# Altium schematic sheet ESP32-S2.SchDoc
size B; SheetNumber: 5; SheetTotal: 9
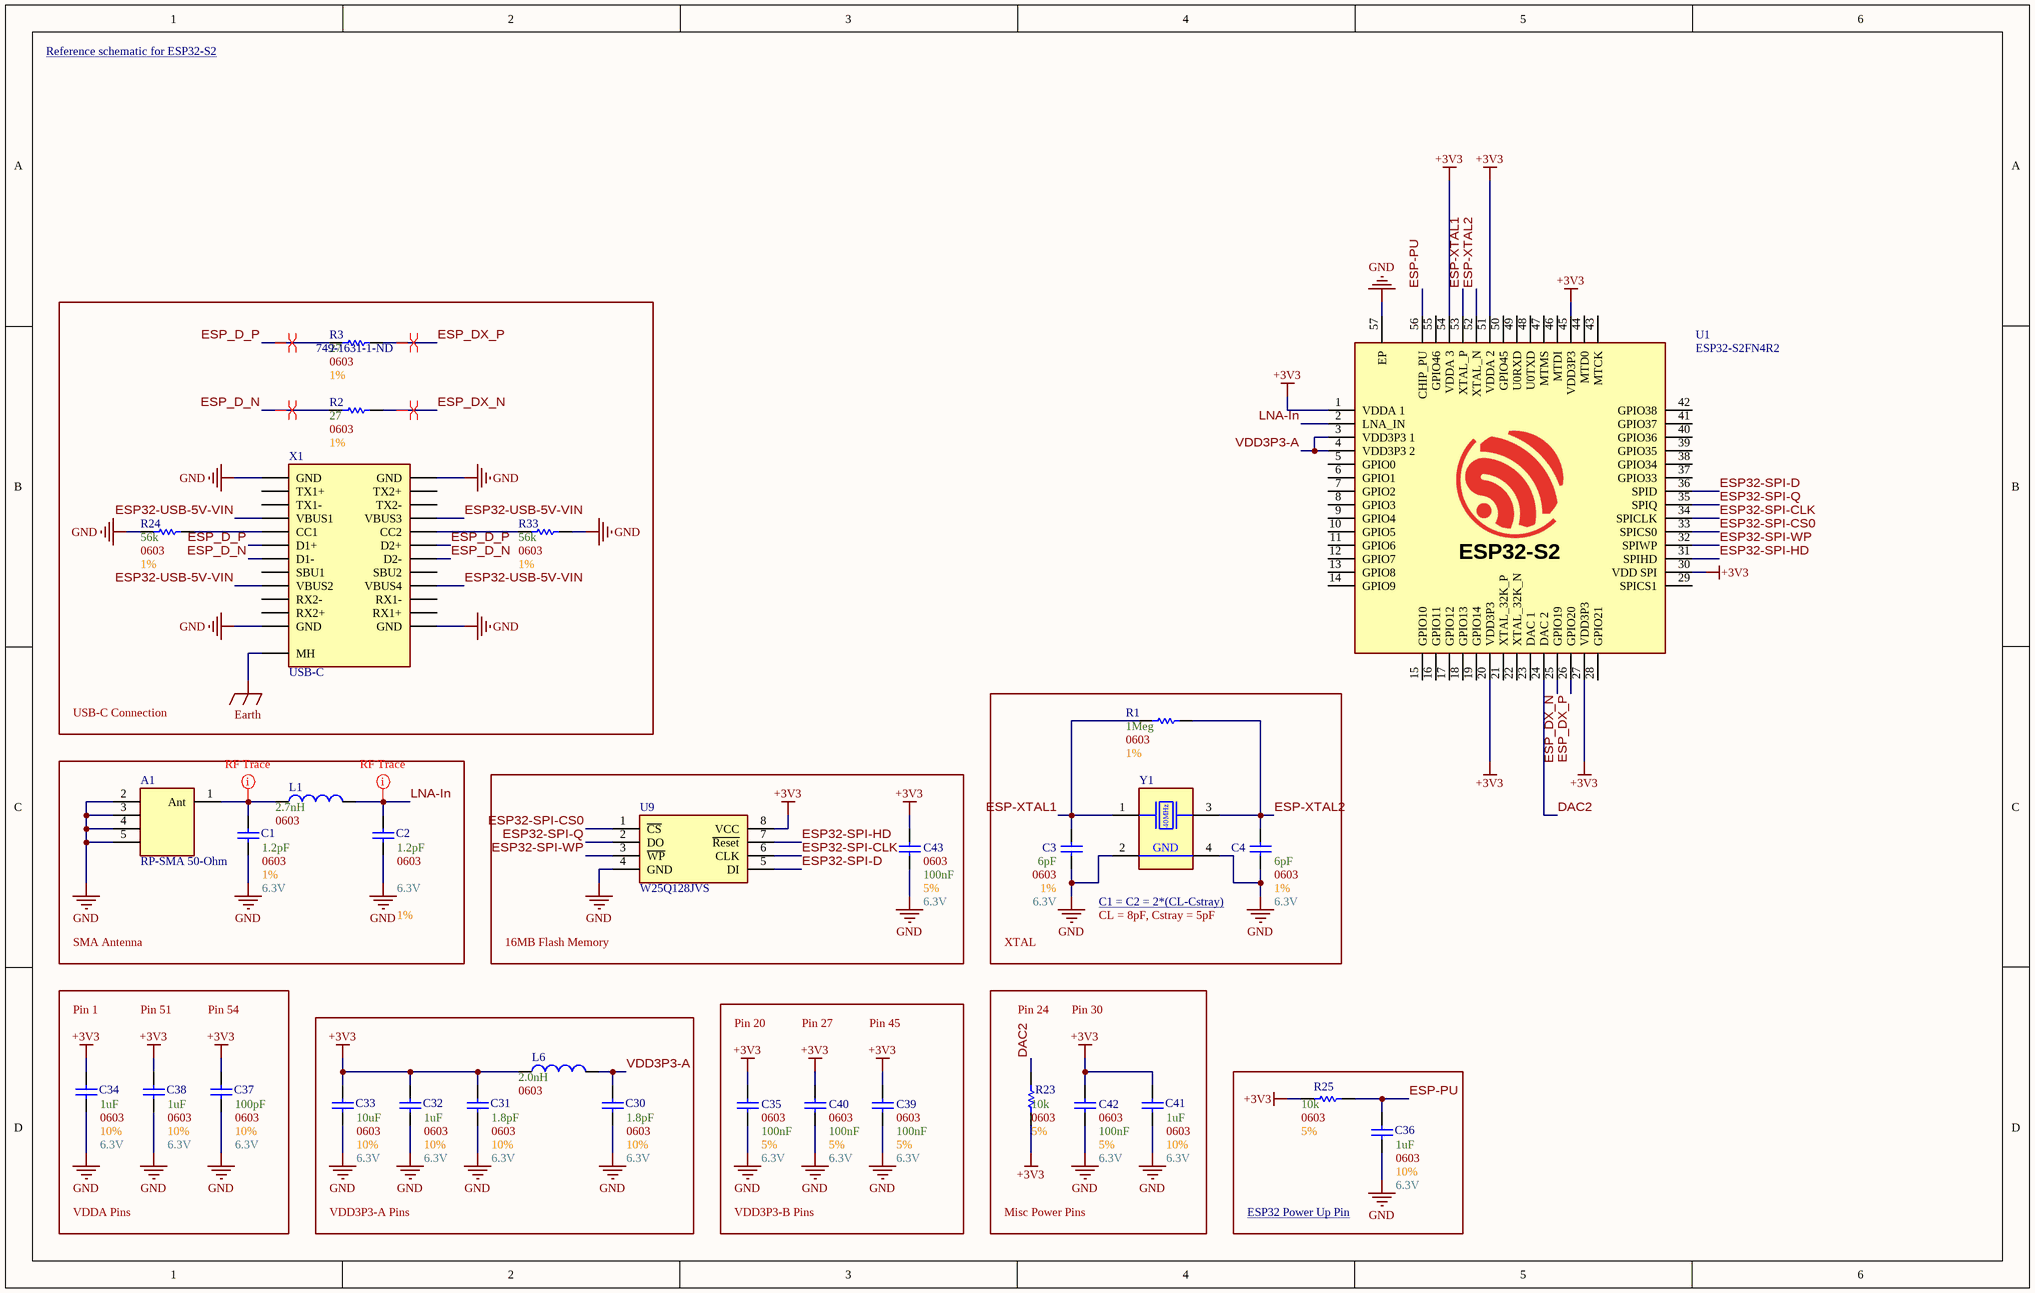
[diagram p0: ESP32-S2.SchDoc]

## Parts
A1  RP-SMA 50-Ohm  [[SMA] RP-SMA 90deg Jack]
C1  Voltage: 6.3V  Tolerance: 1%  Size Package: 0603  Capacitance: 1.2pF  [[Cap] SMD 0603]  (hidden comment: SMD Nonpolarized)
C2  Voltage: 6.3V  Tolerance: 1%  Size Package: 0603  Capacitance: 1.2pF  [[Cap] SMD 0603]  (hidden comment: SMD Nonpolarized)
C3  Voltage: 6.3V  Tolerance: 1%  Size Package: 0603  Capacitance: 6pF  [[Cap] SMD 0603]  (hidden comment: SMD Nonpolarized)
C4  Voltage: 6.3V  Tolerance: 1%  Size Package: 0603  Capacitance: 6pF  [[Cap] SMD 0603]  (hidden comment: SMD Nonpolarized)
C30  Voltage: 6.3V  Tolerance: 10%  Size Package: 0603  Capacitance: 1.8pF  [[Cap] SMD 0603]  (hidden comment: SMD Nonpolarized)
C31  Voltage: 6.3V  Tolerance: 10%  Size Package: 0603  Capacitance: 1.8pF  [[Cap] SMD 0603]  (hidden comment: SMD Nonpolarized)
C32  Voltage: 6.3V  Tolerance: 10%  Size Package: 0603  Capacitance: 1uF  [[Cap] SMD 0603]  (hidden comment: SMD Nonpolarized)
C33  Voltage: 6.3V  Tolerance: 10%  Size Package: 0603  Capacitance: 10uF  [[Cap] SMD 0603]  (hidden comment: SMD Nonpolarized)
C34  Voltage: 6.3V  Tolerance: 10%  Size Package: 0603  Capacitance: 1uF  [[Cap] SMD 0603]  (hidden comment: SMD Nonpolarized)
C35  Size Package: 0603  Capacitance: 100nF  Voltage: 6.3V  Tolerance: 5%  [[Cap] SMD 0603]  (hidden comment: [Cap] SMD Nonpolarized)
C36  Voltage: 6.3V  Tolerance: 10%  Size Package: 0603  Capacitance: 1uF  [[Cap] SMD 0603]  (hidden comment: SMD Nonpolarized)
C37  Voltage: 6.3V  Tolerance: 10%  Size Package: 0603  Capacitance: 100pF  [[Cap] SMD 0603]  (hidden comment: SMD Nonpolarized)
C38  Voltage: 6.3V  Tolerance: 10%  Size Package: 0603  Capacitance: 1uF  [[Cap] SMD 0603]  (hidden comment: SMD Nonpolarized)
C39  Size Package: 0603  Capacitance: 100nF  Voltage: 6.3V  Tolerance: 5%  [[Cap] SMD 0603]  (hidden comment: [Cap] SMD Nonpolarized)
C40  Size Package: 0603  Capacitance: 100nF  Voltage: 6.3V  Tolerance: 5%  [[Cap] SMD 0603]  (hidden comment: [Cap] SMD Nonpolarized)
C41  Voltage: 6.3V  Tolerance: 10%  Size Package: 0603  Capacitance: 1uF  [[Cap] SMD 0603]  (hidden comment: SMD Nonpolarized)
C42  Size Package: 0603  Capacitance: 100nF  Voltage: 6.3V  Tolerance: 5%  [[Cap] SMD 0603]  (hidden comment: [Cap] SMD Nonpolarized)
C43  Size Package: 0603  Capacitance: 100nF  Voltage: 6.3V  Tolerance: 5%  [[Cap] SMD 0603]  (hidden comment: [Cap] SMD Nonpolarized)
L1  Size Package: 0603  Inductance: 2.7nH  [[Inductor] SMD 0603]  (hidden comment: SMD Inductor)
L6  Size Package: 0603  Inductance: 2.0nH  [[Inductor] SMD 0603]  (hidden comment: SMD Inductor)
R1  Tolerance: 1%  Resistance: 1Meg  Size Package: 0603  [[Res] SMD 0603]  (hidden comment: [Res] SMD Resistor)
R2  Tolerance: 1%  Resistance: 27  Size Package: 0603  [[Res] SMD 0603]  (hidden comment: [Res] SMD Resistor)
R3  Tolerance: 1%  Resistance: 27  Size Package: 0603  Supplier Part Number 1: 749-1631-1-ND  [[Res] SMD 0603]  (hidden comment: [Res] SMD Resistor)
R23  Tolerance: 5%  Resistance: 10k  Size Package: 0603  [[Res] SMD 0603]  (hidden comment: [Res] SMD Resistor)
R24  Tolerance: 1%  Resistance: 56k  Size Package: 0603  [[Res] SMD 0603]  (hidden comment: [Res] SMD Resistor)
R25  Tolerance: 5%  Resistance: 10k  Size Package: 0603  [[Res] SMD 0603]  (hidden comment: [Res] SMD Resistor)
R33  Tolerance: 1%  Resistance: 56k  Size Package: 0603  [[Res] SMD 0603]  (hidden comment: [Res] SMD Resistor)
U1  ESP32-S2FN4R2  [[MCU] ESP32-S2]
U9  W25Q128JVS  [[Mem] 16Mb Flash Memory]
X1  USB-C  [[Port] USB-C]
Y1  40MHz Crystal  [[XTAL] SMD 40MHz]  (value not drawn)

## Blocks framed on the sheet
USB-C Connection: R2 R3 R24 R33 X1
SMA Antenna: A1 C1 C2 L1
16MB Flash Memory: C43 U9
VDD3P3-A Pins: C30-C33 L6
ESP32 Power Up Pin: C36 R25

## Nets
+3V3: C31.2 C32.2 C33.2 C34.2 C35.2 C37.2 C38.2 C39.2 C40.2 C41.2 C42.2 C43.2 L6.1 R23.1 R25.1 U1.1(VDDA_1) U1.20(VDD3P3) U1.27(VDD3P3) U1.30(VDD_SPI) U1.45(VDD3P3) U1.51(VDDA_2) U1.54(VDDA_3) U9.8(VCC)
Earth: X1.MH
GND: A1.2 A1.3 A1.4 A1.5 C1.1 C2.1 C3.1 C4.1 C30.1 C31.1 C32.1 C33.1 C34.1 C35.1 C36.1 C37.1 C38.1 C39.1 C40.1 C41.1 C42.1 C43.1 R24.1 R33.2 U1.57(EP) U9.4(GND) X1.A1(GND) X1.A12(GND) X1.B1(GND) X1.B12(GND) Y1.2(GND) Y1.4(GND)
DAC2: R23.2 U1.24(DAC_2)
ESP32-SPI-CLK: U1.34(SPICLK) U9.6(CLK)
ESP32-SPI-CS0: U1.33(SPICS0) U9.1(~{CS})
ESP32-SPI-D: U1.36(SPID) U9.5(DI)
ESP32-SPI-HD: U1.31(SPIHD) U9.7(~{Reset})
ESP32-SPI-Q: U1.35(SPIQ) U9.2(DO)
ESP32-SPI-WP: U1.32(SPIWP) U9.3(~{WP})
ESP32-USB-5V-VIN: X1.A4(VBUS1) X1.A9(VBUS2) X1.B4(VBUS3) X1.B9(VBUS4)
ESP-PU: C36.2 R25.2 U1.56(CHIP_PU)
ESP-XTAL1: C3.2 R1.2 U1.53(XTAL_P) Y1.1(XTAL1)
ESP-XTAL2: C4.2 R1.1 U1.52(XTAL_N) Y1.3(XTAL2)
ESP_D_N: R2.1 X1.A7(D1-) X1.B7(D2-)
ESP_D_P: R3.1 X1.A6(D1+) X1.B6(D2+)
ESP_DX_N: R2.2 U1.25(GPIO19)
ESP_DX_P: R3.2 U1.26(GPIO20)
LNA-In: C2.2 L1.2 U1.2(LNA_IN)
VDD3P3-A: C30.2 L6.2 U1.3(VDD3P3_1) U1.4(VDD3P3_2)
NetA1_1: A1.1(Ant) C1.2 L1.1
NetR24_2: R24.2 X1.A5(CC1)
NetR33_1: R33.1 X1.B5(CC2)

Not connected (* = marked no-connect by the designer): U1 5(GPIO0) 6(GPIO1) 7(GPIO2) 8(GPIO3) 9(GPIO4) 10(GPIO5) 11(GPIO6) 12(GPIO7) 13(GPIO8) 14(GPIO9) 15(GPIO10) 16(GPIO11) 17(GPIO12) 18(GPIO13) 19(GPIO14) 21(XTAL_32K_P) 22(XTAL_32K_N) 23(DAC_1) 28(GPIO21) 29(SPICS1) 37(GPIO33) 38(GPIO34) 39(GPIO35) 40(GPIO36) 41(GPIO37) 42(GPIO38) 43(MTCK) 44(MTD0) 46(MTDI) 47(MTMS) 48(U0TXD) 49(U0RXD) 50(GPIO45) 55(GPIO46); X1 A2(TX1+) A3(TX1-) A8(SBU1) A10(RX2-) A11(RX2+) B2(TX2+) B3(TX2-) B8(SBU2) B10(RX1-) B11(RX1+)

## Layout directives
differential pair: ESP_D_N, ESP_D_P, ESP_DX_P
differential pair; differential pair class USB_Pairs: ESP_DX_N
net class nRF Signal: LNA-In, NetA1_1

## Notes on the sheet
- Reference schematic for ESP32-S2 <https://docs.espressif.com/projects/esp-hardware-design-guidelines/en/latest/esp32s2/_images/esp32s2-sche-core.png>
- C1 = C2 = 2*(CL-Cstray) <https://microchip.my.site.com/s/article/Calculating-crystal-load-capacitor>
- XTAL
- CL = 8pF, Cstray = 5pF
- Pin 1
- Pin 51
- Pin 54
- Pin 20
- Pin 27
- Pin 45
- Pin 24
- Pin 30
- VDDA Pins
- VDD3P3-B Pins
- Misc Power Pins
- (in symbol [MCU] ESP32-S2) ESP32-S2
- (in symbol [XTAL] SMD 40MHz) 40MHz

## Library data of the parts
A1 = [SMA] RP-SMA 90deg Jack: PCB.RPSMAFRA.HT; Supplier 1: DigiKey; Supplier Part Number 1: 931-1360-ND
C1-C4 C30-C34 C36-C38 C41 = [Cap] SMD Nonpolarized: Supplier 1: DigiKey
  C1 C2: Supplier Part Number 1: 4713-CHV0603N2501R2BCT-ND
  C3 C4: Supplier Part Number 1: 311-1055-1-ND
  C30 C31: Supplier Part Number 1: 478-600S1R8BT250XT4KCT-ND
  C32 C34 C36 C38 C41: Supplier Part Number 1: 1276-6524-1-ND
  C33: Supplier Part Number 1: 587-3258-1-ND
  C37: Supplier Part Number 1: 490-1427-1-ND
L1 L6 = [Inductor] SMD Inductor: JLC Part #: *; Mouser Part #: *; Supplier 1: DigiKey
  L1: Supplier Part Number 1: 732-7447860027GCT-ND
  L6: Supplier Part Number 1: 490-LQW18AS2N0J00DCT-ND
R1-R3 R23-R25 R33 = [Res] SMD Resistor: Generic; Supplier 1: DigiKey
  R1: Supplier Part Number 1: YAG4498CT-ND
  R2: Supplier Part Number 1: 749-1631-1-ND
  R23 R25: Supplier Part Number 1: 311-10.0KHRCT-ND
  R24 R33: Supplier Part Number 1: A129709CT-ND
U1 = [MCU] ESP32-S2: Supplier 1: DigiKey; Supplier Part Number 1: 1965-ESP32-S2FN4R2CT-ND
U9 = [Mem] 16Mb Flash Memory: W25Q128JVSIQ TR; Supplier 1: DigiKey; Supplier Part Number 1: 256-W25Q128JVSIQTRCT-ND
X1 = [Port] USB Type-C: Supplier 1: DigiKey; Supplier Part Number 1: 670-3104-1-ND
Y1 = [XTAL] SMD 40MHz: CX2016DB40000D0FLJCC; Supplier 1: DigiKey; Supplier Part Number 1: 478-CX2016DB40000D0FLJCCDKR-ND
C35 C39 C40 C42 C43 = [Cap] SMD Nonpolarized: Supplier 1: DigiKey; Supplier Part Number 1: 311-1088-6-ND